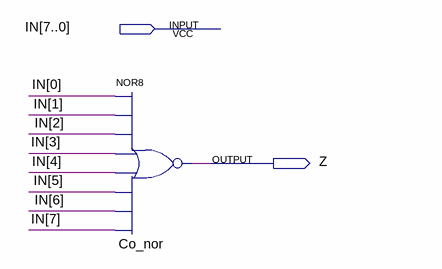
[diagram p0: schematic sheet]
// Quartus schematic flag_z.bdf as structural Verilog: 1 symbols, 2 pins
module flag_z (
  input  [7:0] IN,
  output Z
);

  nor Co_nor (Z, IN[0], IN[1], IN[2], IN[3], IN[4], IN[5], IN[6], IN[7]);
endmodule
